# Altium schematic sheet CPU部分(1).SchDoc
size A4
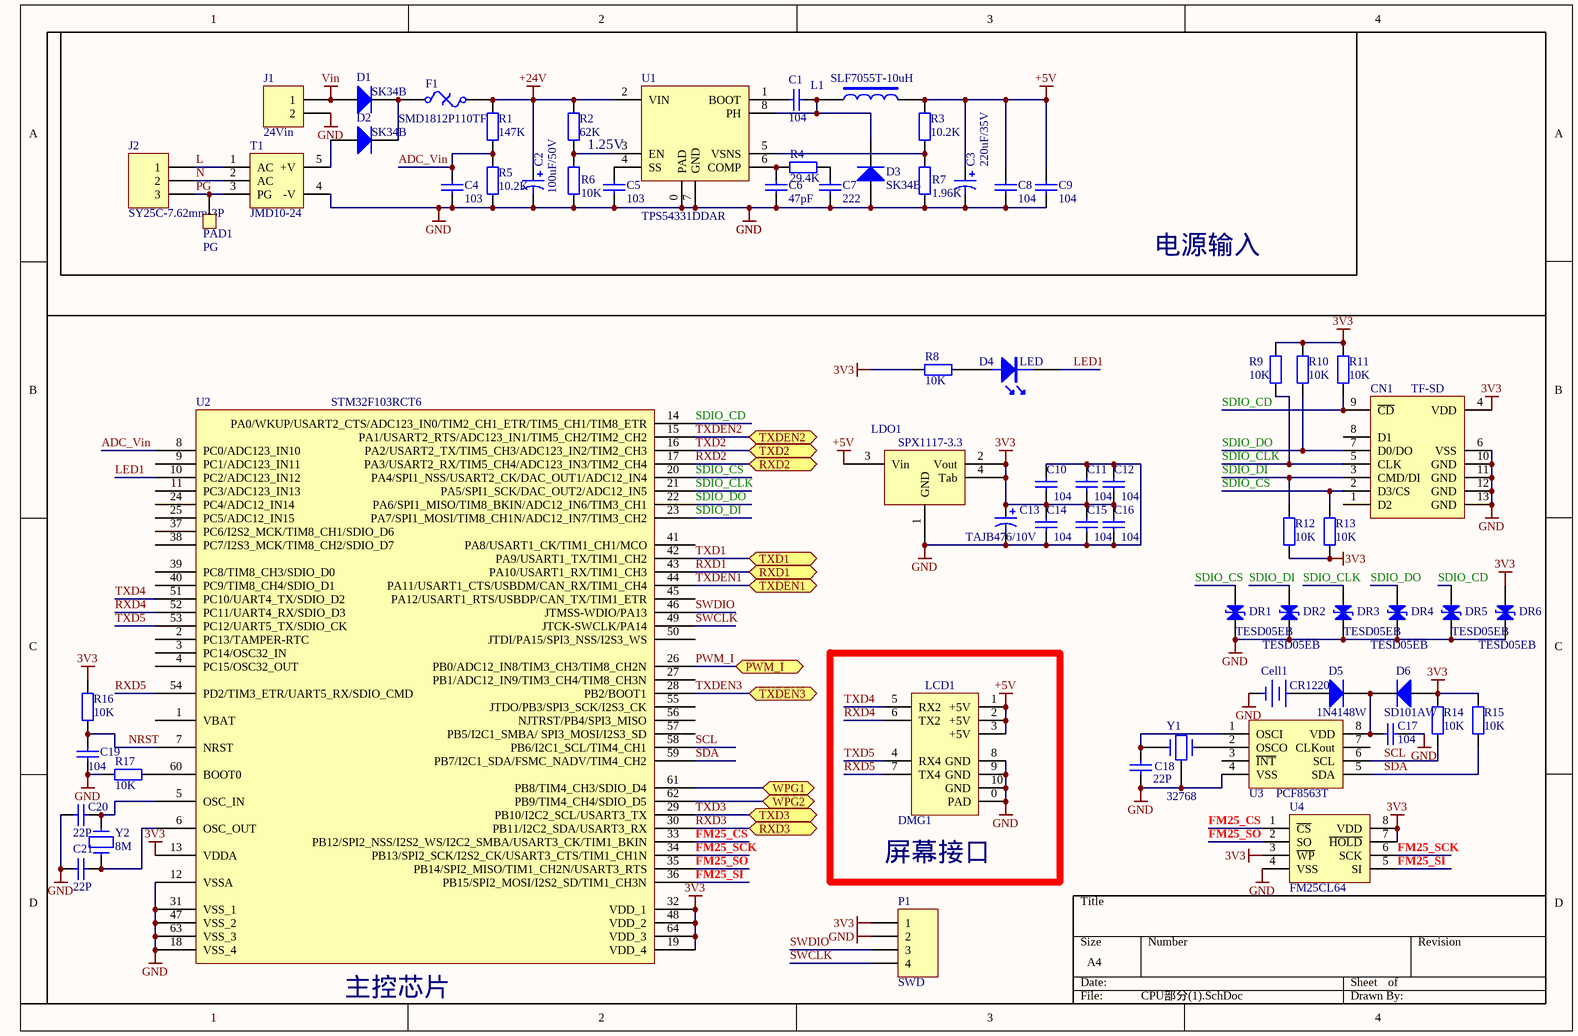
[diagram p0: CPU部分(1).SchDoc]

## Parts
C1  104  [C 0603_M]
C2  100uF/50V  [CT 10*8 - R]
C3  220uF/35V  [CT 10*8 - R]
C4  103  [C 0603_M]
C5  103  [C 0603_M]
C6  47pF  [C 0603_M]
C7  222  [C 0603_M]
C8  104  [C 0603_M]
C9  104  [C 0603_M]
C10  104  [C 0603_M]
C11  104  [C 0603_M]
C12  104  [C 0603_M]
C13  TAJB476/10V  [3528]
C14  104  [C 0603_M]
C15  104  [C 0603_M]
C16  104  [C 0603_M]
C17  104  [C 0603_M]
C18  22P  [C 0603_M]
C19  104  [C 0603_M]
C20  22P  [C 0603_M]
C21  22P  [C 0603_M]
Cell1  CR1220  [BT-3V]
CN1  TF-SD  [TF-01A]
D1  SK34B  [SK34B]
D2  SK34B  [SK34B]
D3  SK34B  [SK34B]
D4  LED  [D0603]
D5  1N4148W  [SOD-123]
D6  SD101AW  [SOD-123]
DMG1  LCD1  [FCC1.0*10]
DR1  TESD05EB  [0603-ESD]
DR2  TESD05EB  [0603-ESD]
DR3  TESD05EB  [0603-ESD]
DR4  TESD05EB  [0603-ESD]
DR5  TESD05EB  [0603-ESD]
DR6  TESD05EB  [0603-ESD]
F1  SMD1812P110TF  [1812]
J1  24Vin  [KF128-5.08-2P]
J2  SY25C-7.62mm-3P  [T31-3]
L1  SLF7055T-10uH  [SLF7032]
LDO1  SPX1117-3.3  [SOT-223]
P1  SWD  [HDR1X4]
PAD1  PG  [D4.5]
R1  147K  [R 0603_M]
R2  62K  [R 0603_M]
R3  10.2K  [R 0603_M]
R4  29.4K  [R 0603_M]
R5  10.2K  [R 0603_M]
R6  10K  [R 0603_M]
R7  1.96K  [R 0603_M]
R8  10K  [R 0603_M]
R9  10K  [0603]
R10  10K  [0603]
R11  10K  [0603]
R12  10K  [0603]
R13  10K  [0603]
R14  10K  [R 0603_M]
R15  10K  [R 0603_M]
R16  10K  [R 0603_M]
R17  10K  [R 0603_M]
T1  JMD10-24  [JMD10-24]
U1  TPS54331DDAR  [SO_PAD-8]
U2  STM32F103RCT6  [QFP64]
U3  PCF8563T  [SO-8]
U4  FM25CL64  [SO-8]
Y1  32768  [32768]
Y2  8M  [OSC HC-49SMD]

## Blocks framed on the sheet
电源输入: C1-C9 D1-D3 F1 J1 J2 L1 PAD1 R1-R7 T1 U1
主控芯片: C10-C21 Cell1 CN1 D4-D6 DR1-DR6 LDO1 P1 R8-R17 U2-U4 Y1 Y2
屏幕接口: DMG1

## Ports
PWM_I (bidir), RXD1 (bidir), RXD2 (bidir), RXD3 (bidir), TXD1 (bidir), TXD2 (bidir), TXD3 (bidir), TXDEN1 (bidir), TXDEN2 (bidir), TXDEN3 (bidir), WPG1, WPG2

## Nets
3V3: C10.1 C11.1 C12.1 C13.1 C14.2 C15.2 C16.2 CN1.4(VDD) D6.1(A) DR6.1(A) LDO1.2(Vout) LDO1.4(Tab) P1.1 R8.2 R9.1 R10.1 R11.1 R12.2 R13.2 R14.1 R15.2 R16.1 U2.13(VDDA) U2.19(VDD_4) U2.32(VDD_1) U2.48(VDD_2) U2.64(VDD_3) U4.3(~{WP}) U4.7(~{HOLD}) U4.8(VDD)
+5V: C3.1 C8.1 C9.1 DMG1.1(+5V) DMG1.2(+5V) DMG1.3(+5V) L1.2 LDO1.3(Vin) R3.1
+24V: C2.1 F1.1 R1.1 R2.1 U1.2(VIN)
GND: C2.2 C3.2 C4.2 C5.2 C6.2 C7.2 C8.2 C9.2 C10.2 C11.2 C12.2 C13.2 C14.1 C15.1 C16.1 C17.1 C18.1 C19.1 C20.2 C21.2 Cell1.2 CN1.6(VSS) CN1.10(GND) CN1.11(GND) CN1.12(GND) CN1.13(GND) D3.1(A) DMG1.0(PAD) DMG1.8(GND) DMG1.9(GND) DMG1.10(GND) DR1.2(K) DR2.2(K) DR3.2(K) DR4.2(K) DR5.2(K) DR6.2(K) J1.2 LDO1.1(GND) P1.2 R5.1 R6.2 R7.2 R17.2 T1.4(-V) U1.0(PAD) U1.7(GND) U2.12(VSSA) U2.18(VSS_4) U2.31(VSS_1) U2.47(VSS_2) U2.63(VSS_3) U3.4(VSS) U4.4(VSS) Y1.3
Vin: D1.1(A) J1.1
ADC_Vin: C4.1 R1.2 R5.2 U2.8(PC0/ADC123_IN10)
FM25_CS: U2.33(PB12/SPI2_NSS/I2S2_WS/I2C2_SMBA/USART3_CK/TIM1_BKIN) U4.1(~{CS})
FM25_SCK: U2.34(PB13/SPI2_SCK/I2S2_CK/USART3_CTS/TIM1_CH1N) U4.6(SCK)
FM25_SI: U2.36(PB15/SPI2_MOSI/I2S2_SD/TIM1_CH3N) U4.5(SI)
FM25_SO: U2.35(PB14/SPI2_MISO/TIM1_CH2N/USART3_RTS) U4.2(SO)
L: J2.1 T1.1(AC)
LED1: D4.K U2.10(PC2/ADC123_IN12)
N: J2.2 T1.2(AC)
NRST: C19.2 R16.2 U2.7(NRST)
PG: J2.3 PAD1.1 T1.3(PG)
PWM_I: U2.26(PB0/ADC12_IN8/TIM3_CH3/TIM8_CH2N) ; port PWM_I
RXD1: U2.43(PA10/USART1_RX/TIM1_CH3) ; port RXD1
RXD2: U2.17(PA3/USART2_RX/TIM5_CH4/ADC123_IN3/TIM2_CH4) ; port RXD2
RXD3: U2.30(PB11/I2C2_SDA/USART3_RX) ; port RXD3
RXD4: DMG1.6(TX2) U2.52(PC11/UART4_RX/SDIO_D3)
RXD5: DMG1.7(TX4) U2.54(PD2/TIM3_ETR/UART5_RX/SDIO_CMD)
SCL: R14.2 U2.58(PB6/I2C1_SCL/TIM4_CH1) U3.6(SCL)
SDA: R15.1 U2.59(PB7/I2C1_SDA/FSMC_NADV/TIM4_CH2) U3.5(SDA)
SDIO_CD: CN1.9(~{CD}) DR5.1(A) R11.2 U2.14(PA0/WKUP/USART2_CTS/ADC123_IN0/TIM2_CH1_ETR/TIM5_CH1/TIM8_ETR)
SDIO_CLK: CN1.5(CLK) DR3.1(A) R9.2 U2.21(PA5/SPI1_SCK/DAC_OUT2/ADC12_IN5)
SDIO_CS: CN1.2(D3/CS) DR1.1(A) R13.1 U2.20(PA4/SPI1_NSS/USART2_CK/DAC_OUT1/ADC12_IN4)
SDIO_DI: CN1.3(CMD/DI) DR2.1(A) R12.1 U2.23(PA7/SPI1_MOSI/TIM8_CH1N/ADC12_IN7/TIM3_CH2)
SDIO_DO: CN1.7(D0/DO) DR4.1(A) R10.2 U2.22(PA6/SPI1_MISO/TIM8_BKIN/ADC12_IN6/TIM3_CH1)
SWCLK: P1.4 U2.49(JTCK-SWCLK/PA14)
SWDIO: P1.3 U2.46(JTMSS-WDIO/PA13)
TXD1: U2.42(PA9/USART1_TX/TIM1_CH2) ; port TXD1
TXD2: U2.16(PA2/USART2_TX/TIM5_CH3/ADC123_IN2/TIM2_CH3) ; port TXD2
TXD3: U2.29(PB10/I2C2_SCL/USART3_TX) ; port TXD3
TXD4: DMG1.5(RX2) U2.51(PC10/UART4_TX/SDIO_D2)
TXD5: DMG1.4(RX4) U2.53(PC12/UART5_TX/SDIO_CK)
TXDEN1: U2.44(PA11/USART1_CTS/USBDM/CAN_RX/TIM1_CH4) ; port TXDEN1
TXDEN2: U2.15(PA1/USART2_RTS/ADC123_IN1/TIM5_CH2/TIM2_CH2) ; port TXDEN2
TXDEN3: U2.28(PB2/BOOT1) ; port TXDEN3
WPG1: U2.61(PB8/TIM4_CH3/SDIO_D4) ; port WPG1
WPG2: U2.62(PB9/TIM4_CH4/SDIO_D5) ; port WPG2
NetC1_1: C1.1 D3.2(K) L1.1 U1.8(PH)
NetC1_2: C1.2 U1.1(BOOT)
NetC5_1: C5.1 U1.4(SS)
NetC6_1: C6.1 R4.1 U1.6(COMP)
NetC7_1: C7.1 R4.2
NetC17_2: C17.2 D5.2(K) D6.2(K) U3.8(VDD)
NetC18_2: C18.2 U3.1(OSCI) Y1.2
NetC20_1: C20.1 U2.5(OSC_IN) Y2.1
NetC21_1: C21.1 U2.6(OSC_OUT) Y2.2
NetCell1_1: Cell1.1 D5.1(A)
NetD1_2: D1.2(K) D2.2(K) F1.2
NetD2_1: D2.1(A) T1.5(+V)
NetD4_A: D4.A R8.1
NetR2_2: R2.2 R6.1 U1.3(EN)
NetR3_2: R3.2 R7.1 U1.5(VSNS)
NetR17_1: R17.1 U2.60(BOOT0)
NetU3_2: U3.2(OSCO) Y1.1

Not connected (* = marked no-connect by the designer): CN1 1(D2) 8(D1); U2 1(VBAT) 2(PC13/TAMPER-RTC) 3(PC14/OSC32_IN) 4(PC15/OSC32_OUT) 9(PC1/ADC123_IN11) 11(PC3/ADC123_IN13) 24(PC4/ADC12_IN14) 25(PC5/ADC12_IN15) 27(PB1/ADC12_IN9/TIM3_CH4/TIM8_CH3N) 37(PC6/I2S2_MCK/TIM8_CH1/SDIO_D6) 38(PC7/I2S3_MCK/TIM8_CH2/SDIO_D7) 39(PC8/TIM8_CH3/SDIO_D0) 40(PC9/TIM8_CH4/SDIO_D1) 41(PA8/USART1_CK/TIM1_CH1/MCO) 45(PA12/USART1_RTS/USBDP/CAN_TX/TIM1_ETR) 50(JTDI/PA15/SPI3_NSS/I2S3_WS) 55(JTDO/PB3/SPI3_SCK/I2S3_CK) 56(NJTRST/PB4/SPI3_MISO) 57(PB5/I2C1_SMBA/_SPI3_MOSI/I2S3_SD); U3 3(~{INT}) 7(CLKout)

## Notes on the sheet
- 1.25V

## Library data of the parts
C1 C4-C12 C14-C17 = Cap Semi: Capacitor (Semiconductor SIM Model); Published: 8-Jun-2000; LatestRevisionDate: 17-Jul-2002; LatestRevisionNote: Re-released for DXP Platform.; PackageReference: C1206; Publisher: Altium Limited
C2 C3 C13 = Cap Pol1: Polarized Capacitor (Radial)
  C13: Published: 8-Jun-2000; LatestRevisionDate: 17-Jul-2002; LatestRevisionNote: Re-released for DXP Platform.; PackageReference: RB7.6-15; Publisher: Altium Limited
C18-C21 = Cap: Capacitor; Published: 8-Jun-2000; LatestRevisionDate: 17-Jul-2002; LatestRevisionNote: Re-released for DXP Platform.; PackageReference: RAD-0.3; Publisher: Altium Limited
Cell1 = Cell
CN1 = TF_SD
D1-D3 D5 D6 = Diode 1N4007: 1 Amp General Purpose Rectifier; Published: 8-Jun-2000; LatestRevisionDate: 17-Jul-2002; LatestRevisionNote: Re-released for DXP Platform.; DatasheetDocument: 1998; PackageDocument: Aug-1999; PackageReference: DO-41; Publisher: Altium Limited; Code_JEDEC: DO-204-AL; ComponentLink1Description: Manufacturer Link; ComponentLink1URL: http://www.fairchildsemi.com/; ComponentLink2Description: Datasheet; ComponentLink2URL: http://www.fairchildsemi.com/ds/1N%2F1N4001.pdf
D4 = LED: RED
DMG1 = DMG48480C040
DR1-DR6 = DR: 瞬态电压抑制二极管; 版权归属: 源创客; BOM名称: 瞬态电压抑制二极管; 学习资源: www.ooocke.com
F1 = Fuse Thermal: Thermal Fuse; Published: 24-Mar-1999; LatestRevisionDate: 17-Jul-2002; LatestRevisionNote: Re-released for DXP Platform.; PackageReference: PIN-W2/E2.8; Publisher: 200mA
J1 = Header 2: Header, 2-Pin; LatestRevisionDate: 17-Jul-2002; LatestRevisionNote: Re-released for DXP Platform.; Publisher: Altium Limited
J2 = Header 3: Header, 3-Pin; LatestRevisionDate: 17-Jul-2002; LatestRevisionNote: Re-released for DXP Platform.; Publisher: Altium Limited
L1 = INDUCTOR2
LDO1 = 1117
P1 = Header 4: Header, 4-Pin; LatestRevisionDate: 17-Jul-2002; LatestRevisionNote: Re-released for DXP Platform.; Publisher: Altium Limited
PAD1 = test
R1-R17 = Res2: Resistor; Published: 8-Jun-2000; LatestRevisionDate: 17-Jul-2002; LatestRevisionNote: Re-released for DXP Platform.; PackageReference: AXIAL-0.4; Publisher: Altium Limited
U1 = TPS54331
Y1 Y2 = CRYSTAL